# EAGLE schematic PM_DC_v0.3 (EAGLE 9.6.2)
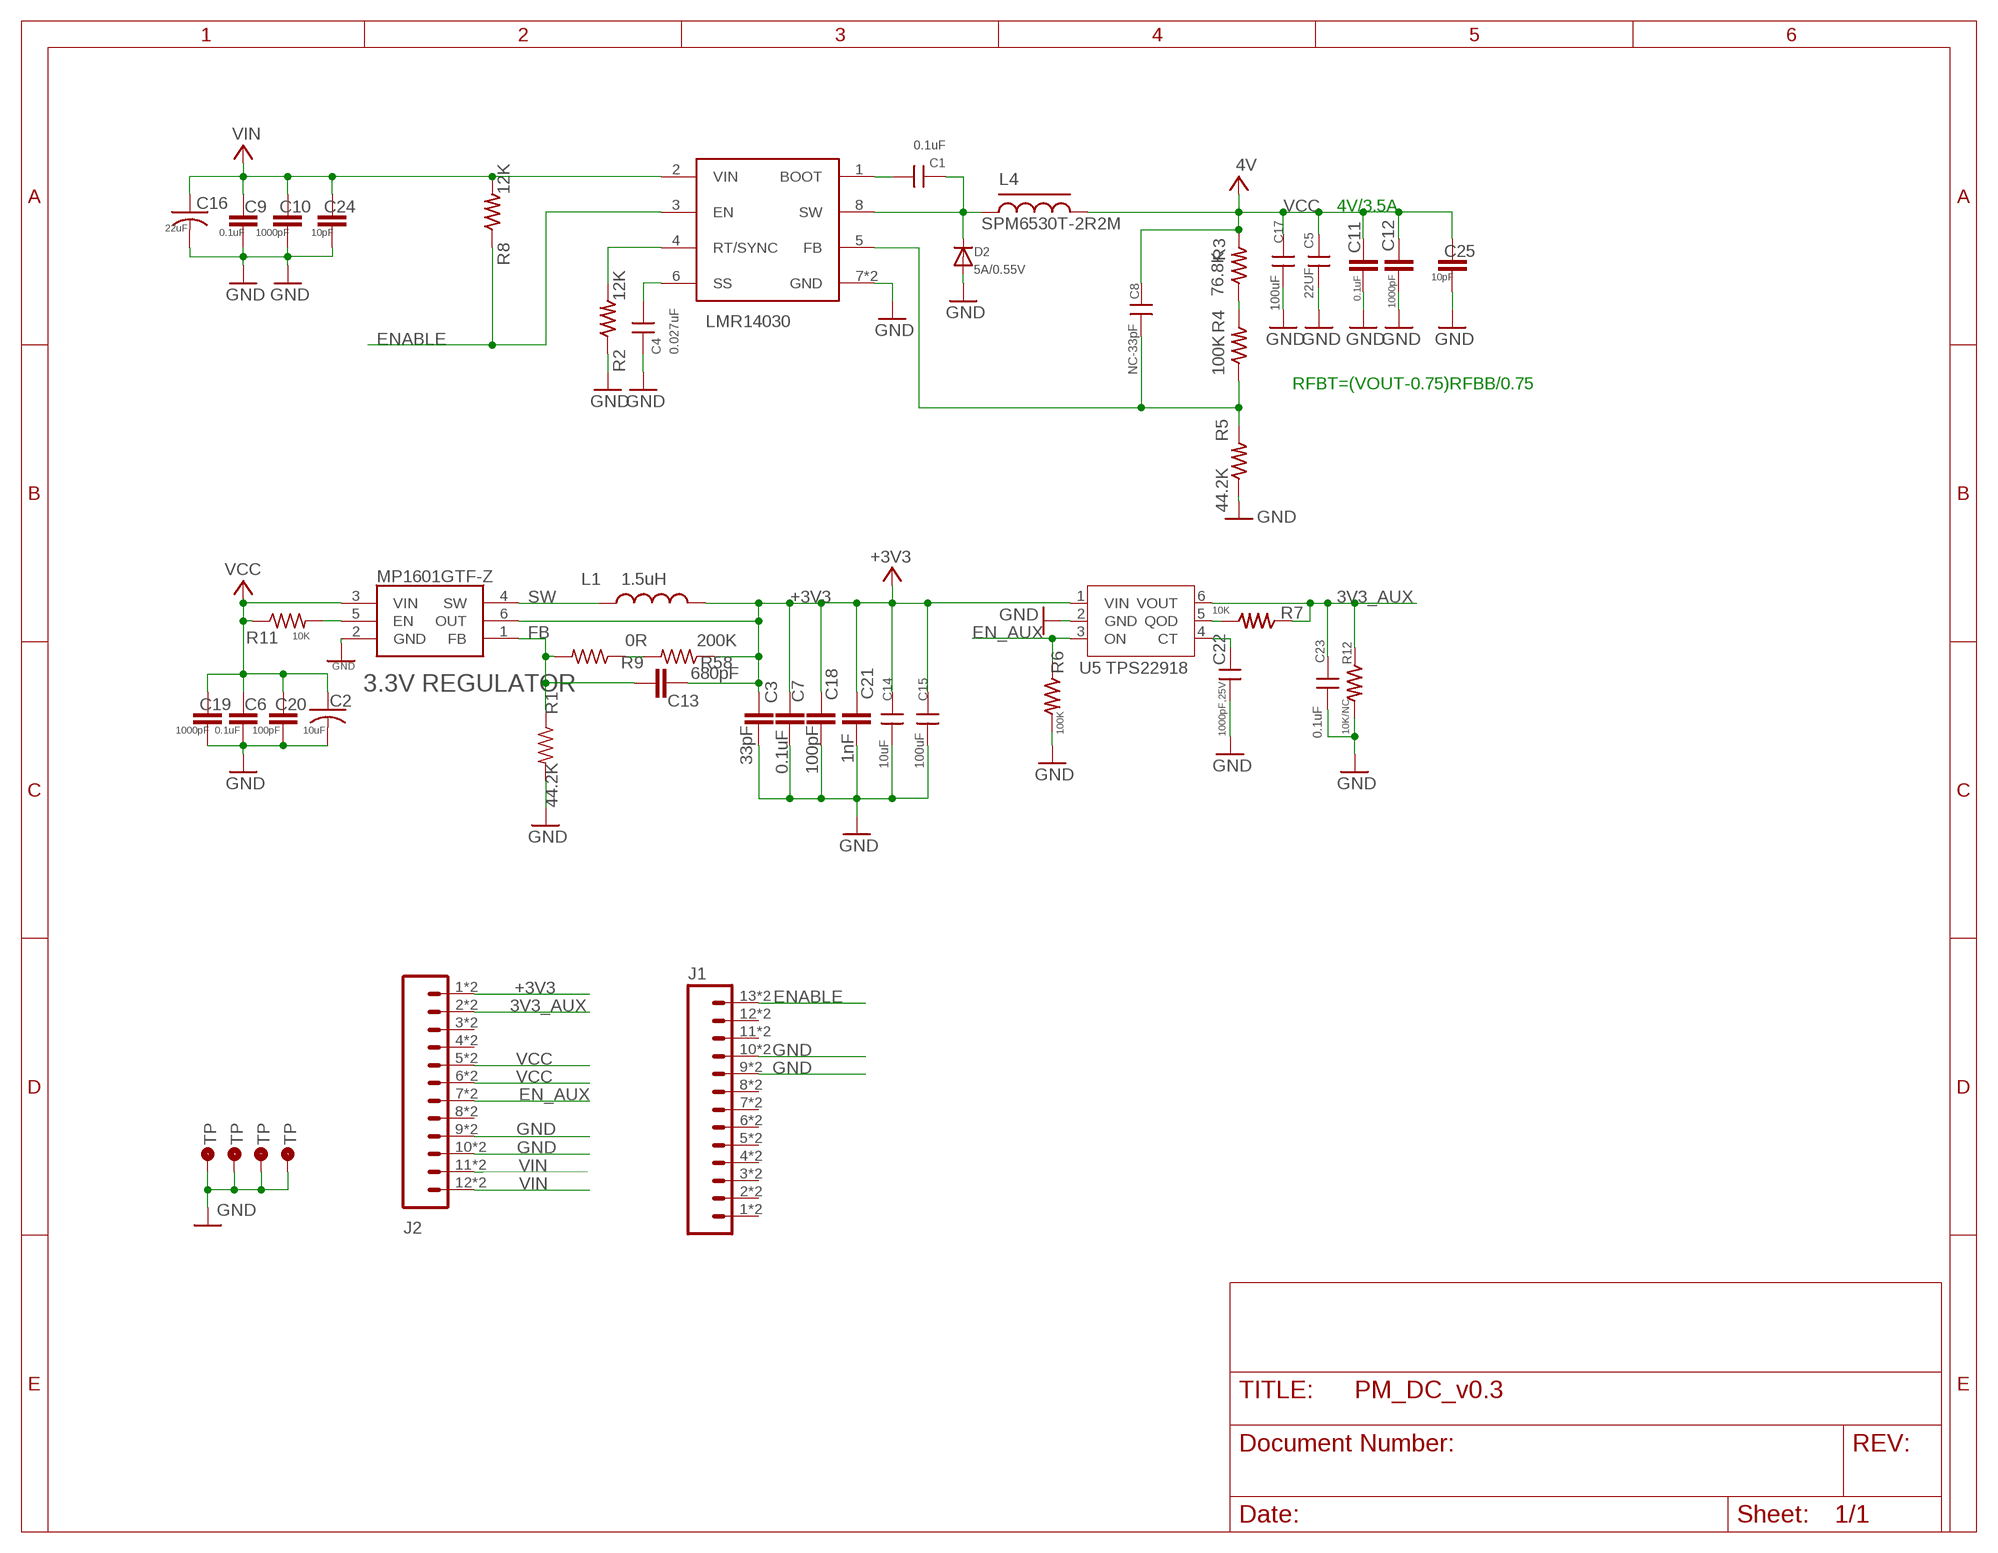
[diagram p0: schematic, sheet 1]

## Parts
C1  0.1uF  CAP0402A  [C0402]
C2  10uF  C-US0603  [C0603_B]
C3  33pF  CAP_1  [C0402_B]
C4  0.027uF  CAP0402A  [C0402]
C5  22UF  CAPC0805  [C0805]
C6  0.1uF  CAP_1  [C0402_B]
C7  0.1uF  CAP_1  [C0402_B]
C8  NC-33pF  CAP0402A  [C0402]
C9  0.1uF  CAP_1  [C0402_B]
C10  1000pF  CAP_1  [C0402_B]
C11  0.1uF  CAP_1  [C0402_B]
C12  1000pF  CAP_1  [C0402_B]
C13  680pF  CAP_1  [C0402_B]
C14  10uF  CAPC0805  [C0805]
C15  100uF  CAPC1206  [C1206]
C16  22uF  C-US0603  [C0603_B]
C17  100uF  CAPC1206  [C1206]
C18  100pF  CAP_1  [C0402_B]
C19  1000pF  CAP_1  [C0402_B]
C20  100pF  CAP_1  [C0402_B]
C21  1nF  CAP_1  [C0402_B]
C22  1000pF,25V  CAP0402A  [C0402]
C23  0.1uF  CAP0402  [C-0402]
C24  10pF  CAP_1  [C0402_B]
C25  10pF  CAP_1  [C0402_B]
D2  5A/0.55V  DIODESMA  [SMADIODE]
J1  M13PTH-CST-R  [1X13-CASTELLATED]
J2  M12PTH-CST-R  [1X12-CASTELLATED]
L1  1.5uH  INDUCTOR-SPARKFUNINDUCTOR-2520  [INDUCTOR-2520]
L4  SPM6530T-2R2M  INDUCTOR  [INDCUTOR_SPM6530]
R1  44.2K  R-US_  [R0402_B]
R2  12K  RES0402S  [R-0402S]
R3  76.8K  RES0402S  [R-0402S]
R4  100K  RES0402S  [R-0402S]
R5  44.2K  RES0402S  [R-0402S]
R6  100K  RESR0402  [R0402]
R7  10K  RESR0402  [R0402]
R8  12K  RES0402S  [R-0402S]
R9  0R  R-US_  [R0402_B]
R11  10K  R-US_  [R0402_B]
R12  10K/NC  RESR0402  [R0402]
R58  200K  R-US_  [R0402_B]
U2  LMR14030  [SO_POWERPAD_8]
U3  MP1601GTF-Z  [SOTFL50P160X60-6N]
U5  TPS22918  [SOT-23-6]
U$1  TP  [TP_2.33X1.37]
U$2  TP  [TP_2.33X1.37]
U$4  TP  [TP_2.33X1.37]
U$5  TP  [TP_2.33X1.37]

## Nets
3V3_AUX: C23.1 J2.2 J2.@2 R7.1 R12.1 U5.6(VOUT)
+3V3: C3.2 C7.2 C13.1 C14.1 C15.1 C18.2 C21.2 J2.1 J2.@1 L1.2 R58.1 U3.6(OUT) U5.1(VIN)
EN_AUX: J2.7 J2.@7 R6.1 U5.3(ON)
ENABLE: J1.13 J1.@13 R8.1 U2.3(EN)
FB: C13.2 R1.1 R9.2 U3.1(FB)
GND: C2.2 C3.1 C4.2 C5.2 C6.1 C7.1 C9.1 C10.1 C11.1 C12.1 C14.2 C15.2 C16.2 C17.2 C18.1 C19.1 C20.1 C21.1 C22.2 C23.2 C24.1 C25.1 D2.A J1.9 J1.10 J1.@9 J1.@10 J2.9 J2.10 J2.@9 J2.@10 R1.2 R2.1 R5.1 R6.2 R12.2 U2.7(GND) U2.EP(GND) U3.2(GND) U5.2(GND) U$1.1(TP) U$2.1(TP) U$4.1(TP) U$5.1(TP)
N$1: R7.2 U5.5(QOD)
N$2: C8.1 R4.1 R5.2 U2.5(FB)
N$3: R11.2 U3.5(EN)
N$4: R9.1 R58.2
N$8: C4.1 U2.6(SS)
N$9: C1.2 D2.C L4.1 U2.8(SW)
N$10: C1.1 U2.1(BOOT)
N$11: R2.2 U2.4(RT/SYNC)
N$12: R3.1 R4.2
N$18: C22.1 U5.4(CT)
SW: L1.1 U3.4(SW)
VCC: C2.1 C5.1 C6.2 C8.2 C11.2 C12.2 C17.1 C19.2 C20.2 C25.2 J2.5 J2.6 J2.@5 J2.@6 L4.2 R3.2 R11.1 U3.3(VIN) ; supply symbol labelled 4V
VIN: C9.2 C10.2 C16.1 C24.2 J2.11 J2.12 J2.@11 J2.@12 R8.2 U2.2(VIN)
Unconnected: J1.1 J1.2 J1.3 J1.4 J1.5 J1.6 J1.7 J1.8 J1.11 J1.12 J1.@1 J1.@2 J1.@3 J1.@4 J1.@5 J1.@6 J1.@7 J1.@8 J1.@11 J1.@12 J2.3 J2.4 J2.8 J2.@3 J2.@4 J2.@8

## Notes on the sheet
- 4V/3.5A
- RFBT=(VOUT-0.75)RFBB/0.75
- 3.3V REGULATOR

## Library data of the parts
C1 C4 C5 C8 C14 C15 C17 = particle SZ:CAP: CAP
C2 C16 = Bretts-Spark-Library:C-US: Capacitor
C3 C6 C7 C9-C13 C18-C21 C24 C25 = Particle:CAP_1
C22 = particle SZ:CAP: CAP; ITEM_NAME: CAP CER 100PF 50V C0G/NP0 0603 5%; ITEM_NUMBER: PT-200458
C23 = particle SZ:CAP: CAP; ITEM_NAME: 0.1UF 16V X7R 0402 10%; ITEM_NUMBER: PT-200649
D2 = particle-studios:DIODE: Diode SMADIODE - SMA Surface Mount Package 20V 1A Schottky Diode Digikey: 641-1014-6-ND DO-1N4148 - Through Hole Small Current Diode SOD-123 20V 1 A (.5mV Vf) Schottky Diode - Digikey: MBRX120TPMSCT-ND SOD-323 10V 570mA (.38mV Vf, 3ns) Schottky Diode - Digikey: ZLLS410CT-ND SOD-523 30V 30mA Schottky Diode (RB751S-40TE61) - Digikey: RB751S-40TE61CT-ND SOT23-R/W - SOT23 Package (R = Solder Paste/Reflow Ovens, W = Hand-Soldering) BAT54Film 40V 300mA - Digikey: 497-7162-1-ND
J1 = Particle:M13PTH-CST-R
J2 = Particle:M12: Header 12 Standard 12-pin 0.1" header. Use with straight break away headers (SKU : PRT-00116), right angle break away headers (PRT-00553), swiss pins (PRT-00743), machine pins (PRT-00117), and female headers (PRT-00115).
L1 = Particle:INDUCTOR-SPARKFUN: Inductors Basic Inductor/Choke - 0603 and 1206. Footprints are not proven and vary greatly between part numbers. SRN6045- 33uH, 20% 1.4A
L4 = particle-studios:INDUCTOR
R1 R9 R58 = Particle:R-US_: 0402 Resistor
R2-R5 R8 = particle SZ:RES: RES
R6 = particle SZ:RES: RES; ITEM_NAME: RES SMD 1M OHM 1% 1/16W 0402; ITEM_NUMBER: PT-201084
R7 R12 = particle SZ:RES: RES; ITEM_NAME: 10K OHM 5% 1/16W 0402; ITEM_NUMBER: PT-200004
R11 = Spark:R-US_: 0402 Resistor
U2 = particle-studios:LMR14030
U3 = MP1601GTF-Z:MP1601GTF-Z: Conv DC-DC Single Step Down 2.3V to 5.5V 6-Pin SOT-563 T/R - Tape and Reel Source: Datasheet <https://www.monolithicpower.com/en/documentview/productdocument/index/version/2/document_type/Datasheet/lang/en/sku/MP1601/document_id/1038/>; DESCRIPTION: Conv DC-DC Single Step Down 2.3V to 5.5V 6-Pin SOT-563 T/R - Tape and Reel; HEIGHT: 0.6mm; MANUFACTURER_NAME: Monolithic Power Systems (MPS); MANUFACTURER_PART_NUMBER: MP1601GTF-Z
U5 = particle SZ:TPS22918
U$1 U$2 U$4 U$5 = Particle:TP: Test Points of all sizes and shapes

## Net classes
0 default: width 0.152 mm, drill 0.203 mm, clearance 0.152 mm
1 power: width 0.254 mm, drill 0.61 mm, clearance 0.203 mm
3 BAT: clearance 0.203 mm
4 3V3: width 0.305 mm, clearance 0.508 mm
6 +3V3: width 0.203 mm, clearance 0.152 mm